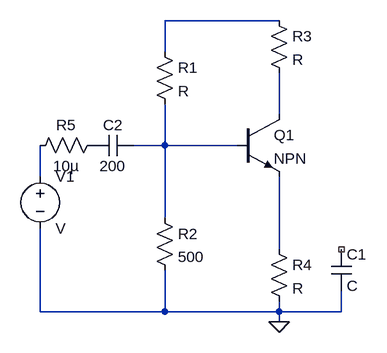
[diagram p0: schematic New.asc]
New.asc, the LTspice schematic file:
Version 4
SHEET 1 880 680
WIRE 240 -16 64 -16
WIRE 64 32 64 -16
WIRE 240 128 240 64
WIRE 64 176 64 112
WIRE 64 176 16 176
WIRE 176 176 64 176
WIRE -128 224 -128 176
WIRE 64 288 64 176
WIRE 240 336 240 224
WIRE -128 432 -128 304
WIRE 64 432 64 368
WIRE 64 432 -128 432
WIRE 240 432 240 416
WIRE 240 432 64 432
WIRE 336 432 336 400
WIRE 336 432 240 432
WIRE 240 448 240 432
FLAG 240 448 0
SYMBOL npn 176 128 R0
SYMATTR InstName Q1
SYMBOL res 48 16 R0
SYMATTR InstName R1
SYMBOL res 48 272 R0
SYMATTR InstName R2
SYMATTR Value 500
SYMBOL res 224 -32 R0
SYMATTR InstName R3
SYMBOL res 224 320 R0
SYMATTR InstName R4
SYMBOL cap 320 336 R0
SYMATTR InstName C1
SYMBOL cap 16 160 R90
WINDOW 0 0 32 VBottom 2
WINDOW 3 32 32 VTop 2
SYMATTR InstName C2
SYMATTR Value 200
SYMBOL res -32 160 R90
WINDOW 0 0 56 VBottom 2
WINDOW 3 32 56 VTop 2
SYMATTR InstName R5
SYMATTR Value 10µ
SYMBOL voltage -128 208 R0
SYMATTR InstName V1

The netlist it stands for:
* New.asc
Q1 N002 N003 N005 0 NPN
R1 N001 N003 R
R2 N003 0 500
R3 N001 N002 R
R4 N005 0 R
C1 NC_01 0 C
C2 N003 P001 200
R5 P001 N004 10µ
V1 N004 0 V
.model NPN NPN
.model PNP PNP
.lib standard.bjt
.backanno
.end